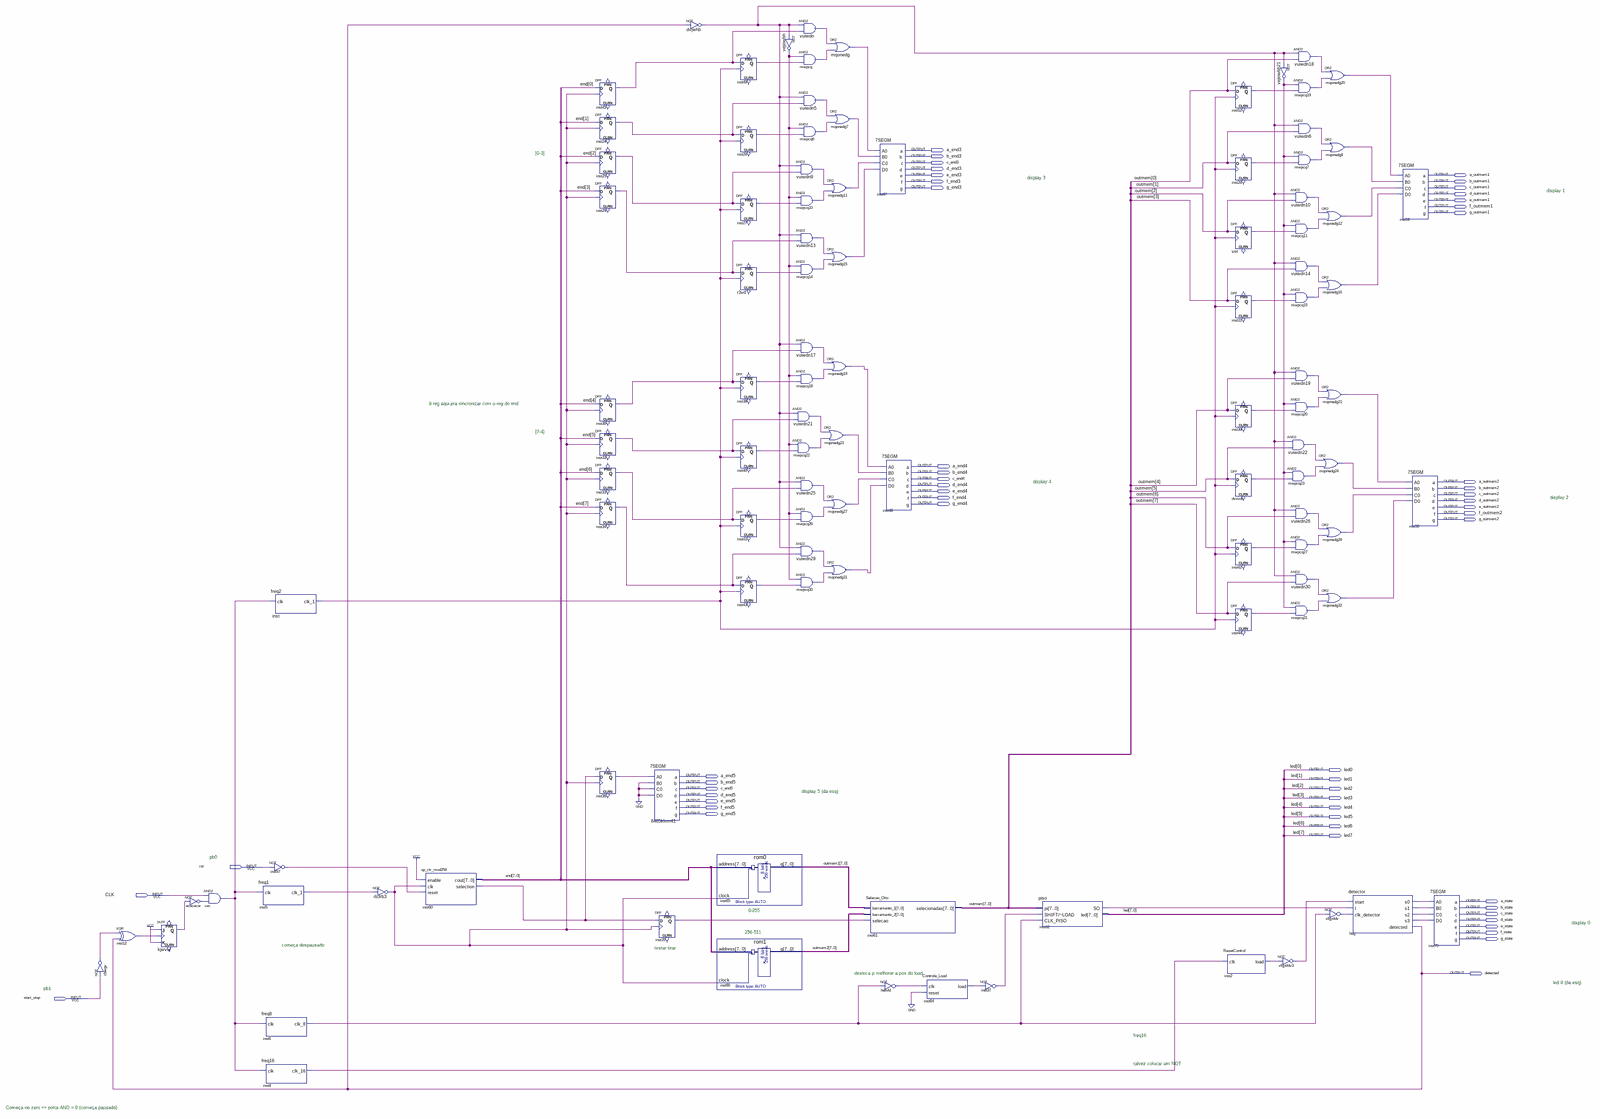
[diagram p0: schematic sheet, whole]
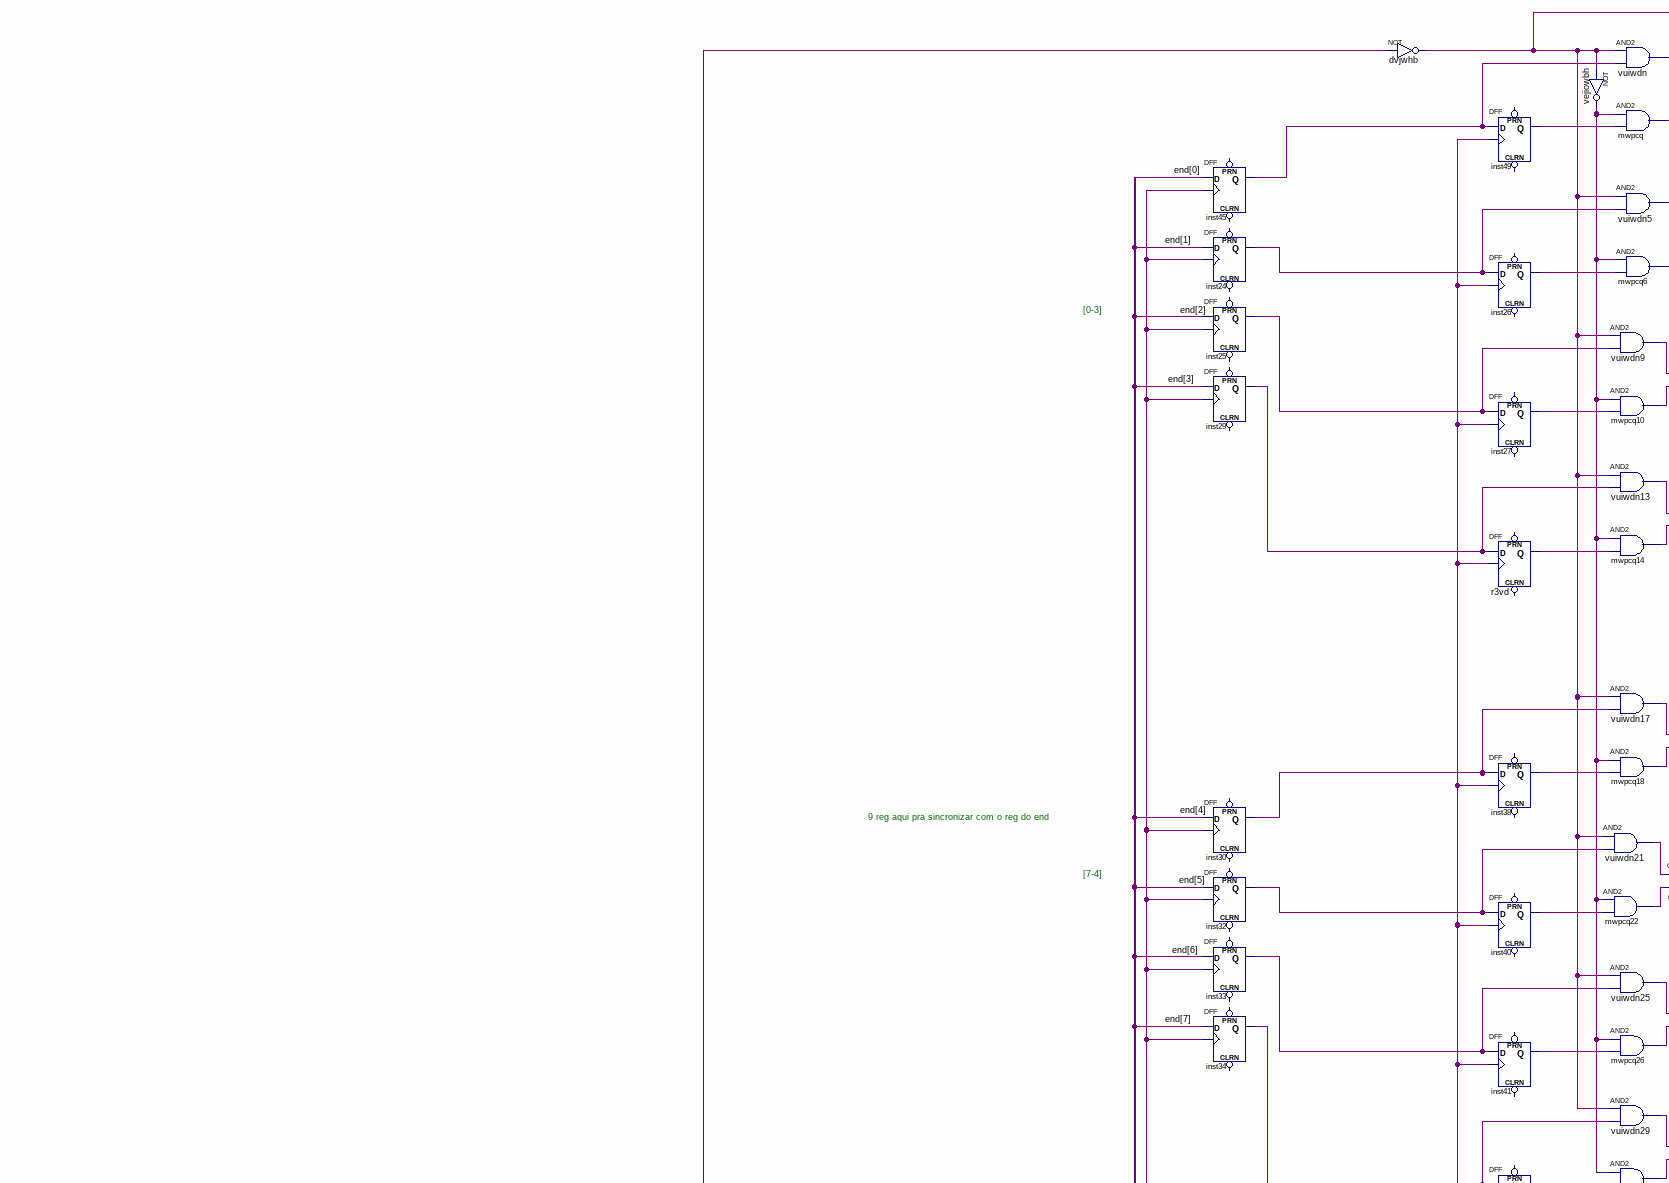
[diagram p1: schematic sheet, upper left part]
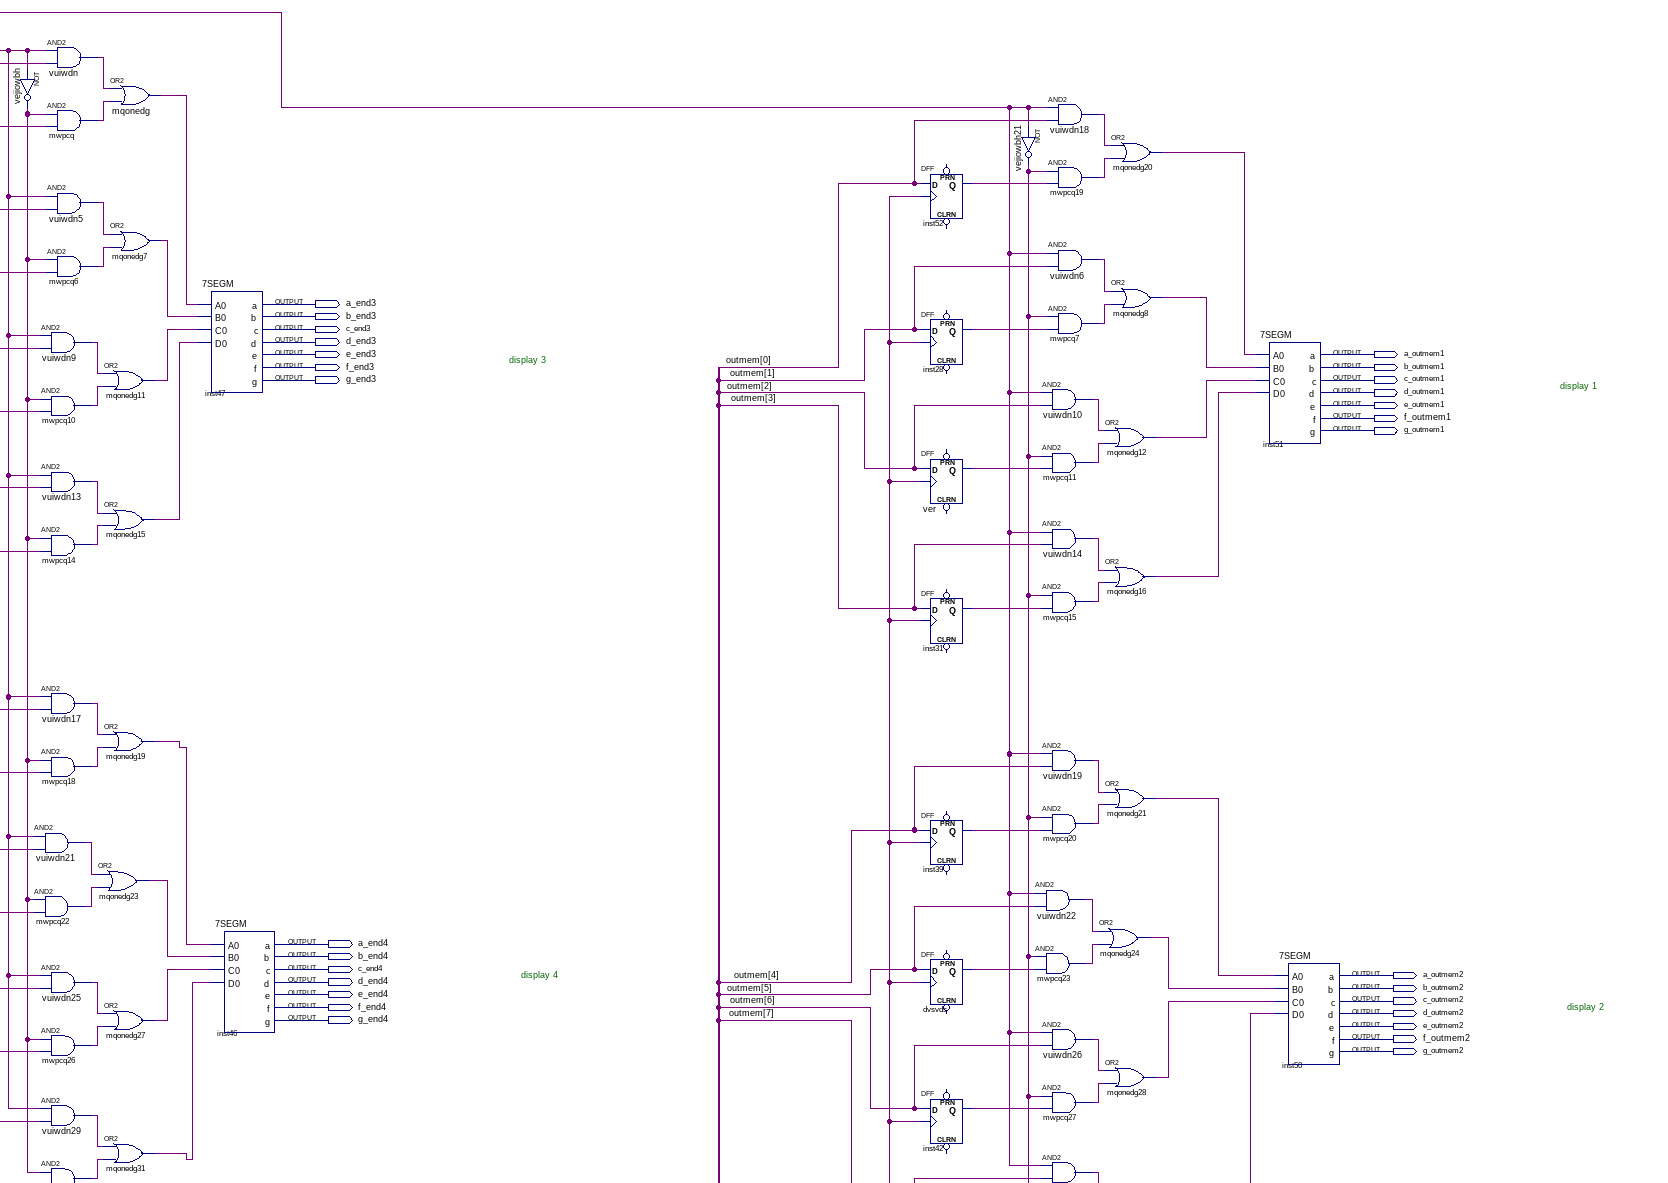
[diagram p2: schematic sheet, upper right part]
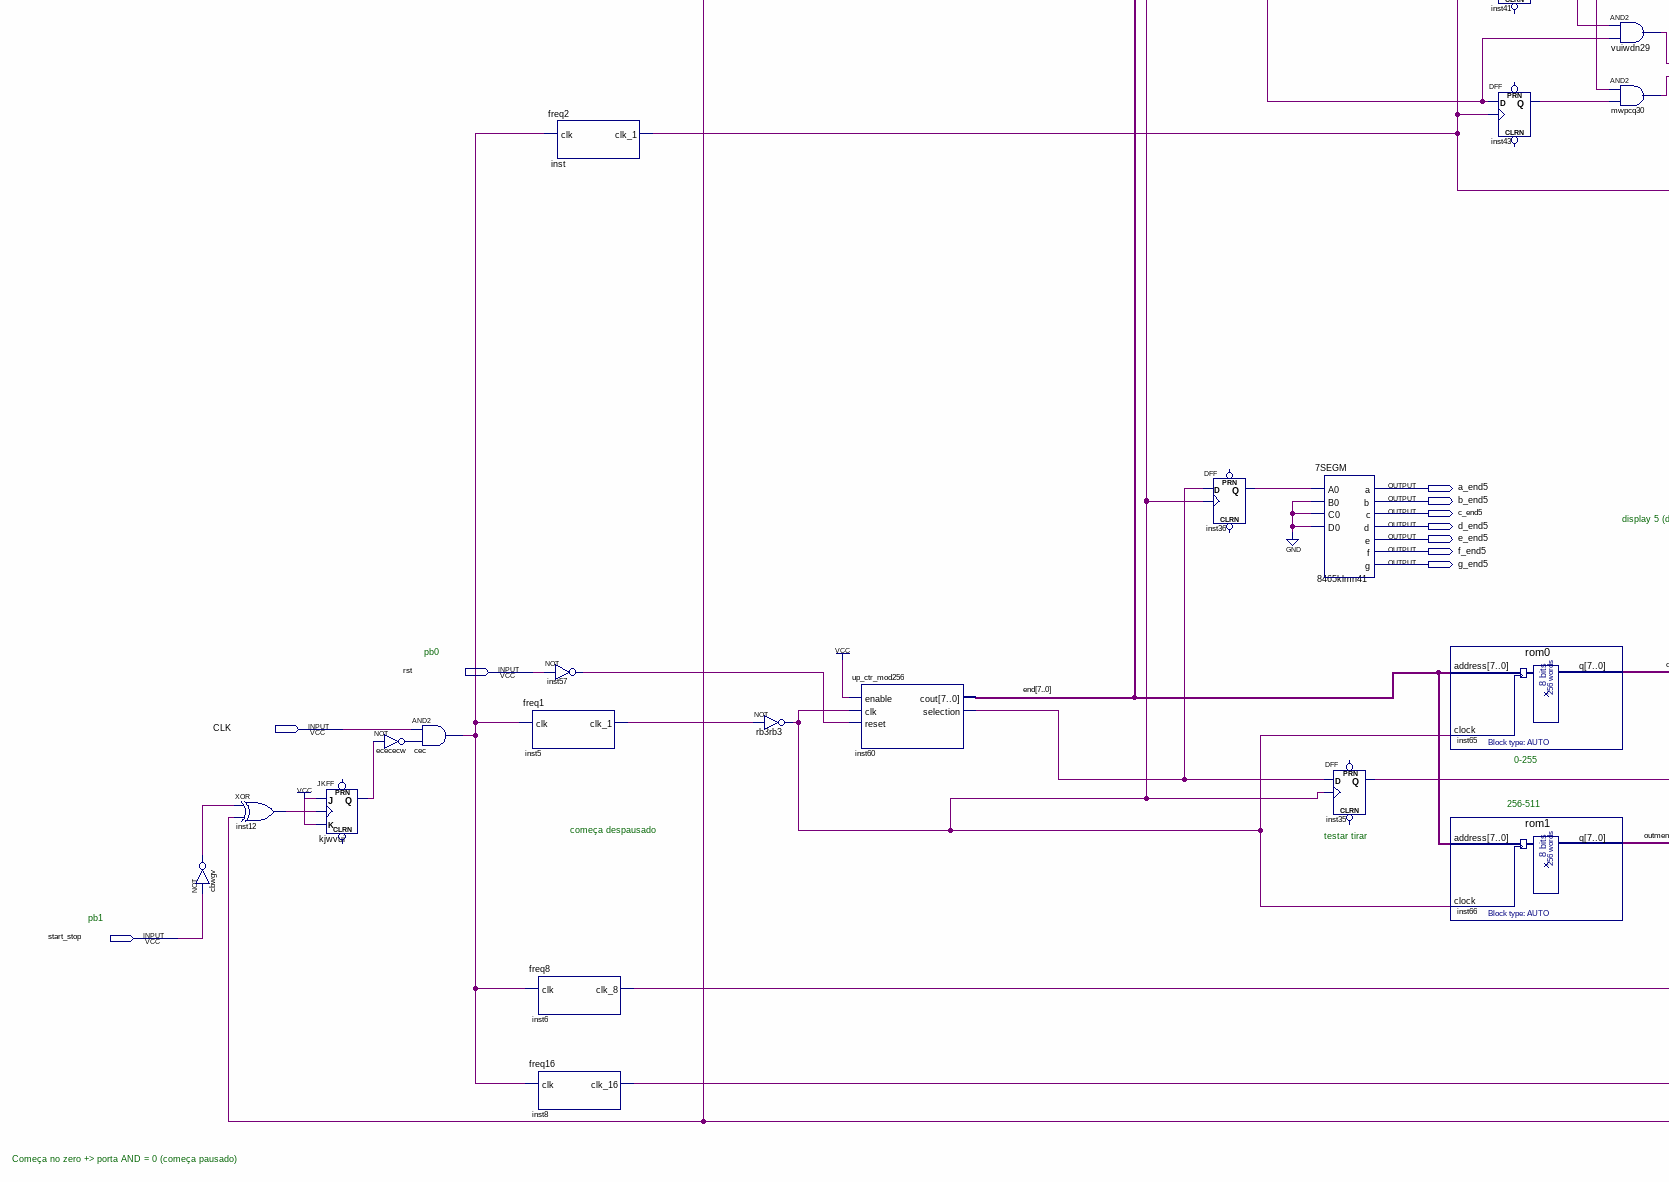
[diagram p3: schematic sheet, lower left part]
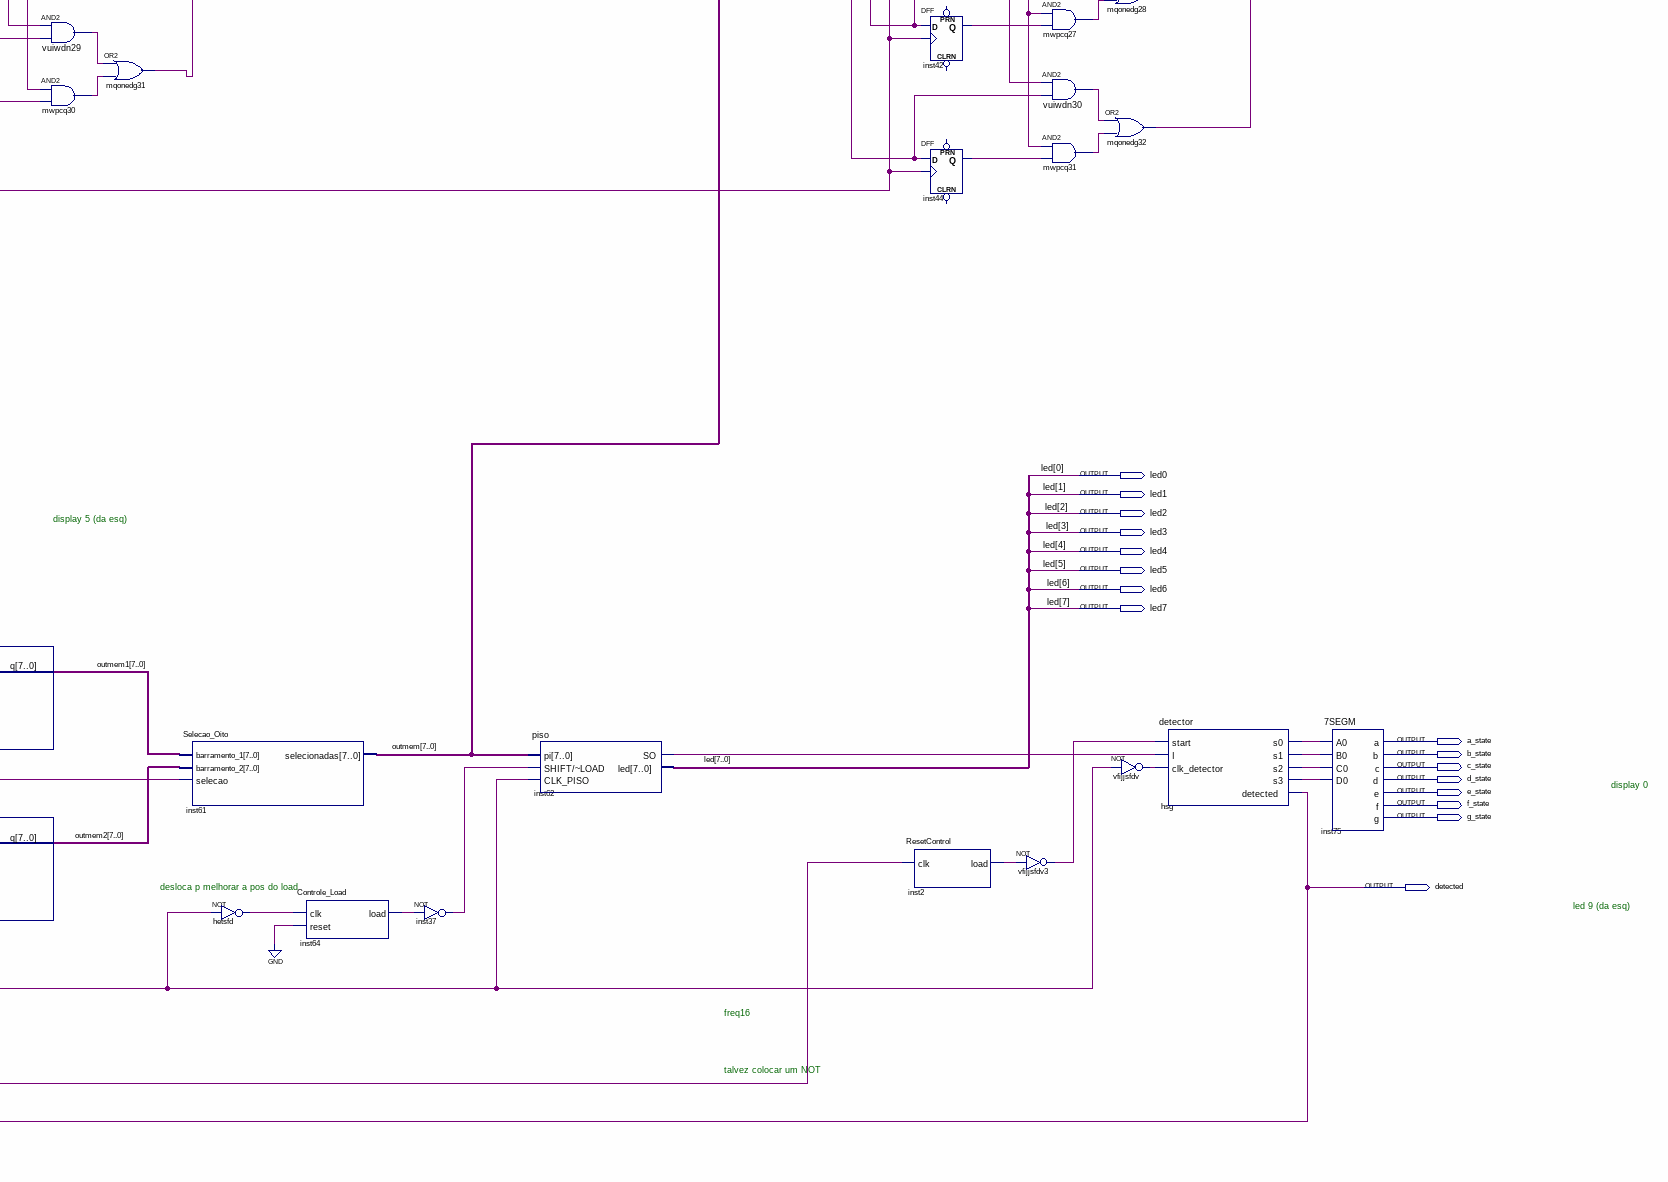
[diagram p4: schematic sheet, lower right part]
// Quartus schematic memoblock.bdf as structural Verilog: 106 symbols, 54 pins
module memoblock (
  input  rst,
  input  CLK,
  input  start_stop,
  output a_end3,
  output b_end3,
  output c_end3,
  output d_end3,
  output e_end3,
  output a_outmem1,
  output f_end3,
  output b_outmem1,
  output g_end3,
  output c_outmem1,
  output d_outmem1,
  output e_outmem1,
  output f_outmem1,
  output g_outmem1,
  output a_end4,
  output b_end4,
  output c_end4,
  output a_outmem2,
  output d_end4,
  output b_outmem2,
  output e_end4,
  output c_outmem2,
  output f_end4,
  output d_outmem2,
  output g_end4,
  output e_outmem2,
  output f_outmem2,
  output g_outmem2,
  output led0,
  output a_end5,
  output led1,
  output b_end5,
  output c_end5,
  output led2,
  output d_end5,
  output led3,
  output e_end5,
  output f_end5,
  output led4,
  output g_end5,
  output led5,
  output led6,
  output led7,
  output a_state,
  output b_state,
  output c_state,
  output d_state,
  output e_state,
  output f_state,
  output g_state,
  output detected
);

  wire cbwgv_out, cec_out, dvjwhb_out, dvsvds_q, ecececw_out, hetsfd_out, hsg_s0, hsg_s1, hsg_s2, hsg_s3,
       inst2_load, inst5_clk_1, inst6_clk_8, inst8_clk_16, inst12_out, inst24_q, inst25_q, inst26_q,
       inst27_q, inst28_q, inst29_q, inst30_q, inst31_q, inst32_q, inst33_q, inst34_q, inst35_q, inst36_q,
       inst37_out, inst38_q, inst39_q, inst40_q, inst41_q, inst42_q, inst43_q, inst44_q, inst45_q, inst49_q,
       inst52_q, inst57_out, inst60_selection, inst62_so, inst64_load, inst_clk_1, kjwvui_q, mqonedg7_out,
       mqonedg8_out, mqonedg11_out, mqonedg12_out, mqonedg15_out, mqonedg16_out, mqonedg19_out,
       mqonedg20_out, mqonedg21_out, mqonedg23_out, mqonedg24_out, mqonedg27_out, mqonedg28_out,
       mqonedg31_out, mqonedg32_out, mqonedg_out, mwpcq6_out, mwpcq7_out, mwpcq10_out, mwpcq11_out,
       mwpcq14_out, mwpcq15_out, mwpcq18_out, mwpcq19_out, mwpcq20_out, mwpcq22_out, mwpcq23_out,
       mwpcq26_out, mwpcq27_out, mwpcq30_out, mwpcq31_out, mwpcq_out, r3vd_q, rb3rb3_out, vejiowbh21_out,
       vejiowbh_out, ver_q, vfijjsfdv3_out, vfijjsfdv_out, vuiwdn5_out, vuiwdn6_out, vuiwdn9_out,
       vuiwdn10_out, vuiwdn13_out, vuiwdn14_out, vuiwdn17_out, vuiwdn18_out, vuiwdn19_out, vuiwdn21_out,
       vuiwdn22_out, vuiwdn25_out, vuiwdn26_out, vuiwdn29_out, vuiwdn30_out, vuiwdn_out;
  wire [7:0] \end , outmem, outmem1, outmem2;

  xor inst12 (inst12_out, cbwgv_out, detected);
  not cbwgv (cbwgv_out, start_stop);
  JKFF kjwvui (.K(1'b1), .J(1'b1), .CLK(inst12_out), .Q(kjwvui_q));  // open: PRN, CLRN
  not ecececw (ecececw_out, kjwvui_q);
  and cec (cec_out, CLK, ecececw_out);
  freq1 inst5 (.clk(cec_out), .clk_1(inst5_clk_1));
  freq8 inst6 (.clk(cec_out), .clk_8(inst6_clk_8));
  freq16 inst8 (.clk(cec_out), .clk_16(inst8_clk_16));
  freq2 inst (.clk(cec_out), .clk_1(inst_clk_1));
  not inst57 (inst57_out, rst);
  not rb3rb3 (rb3rb3_out, inst5_clk_1);
  up_ctr_mod256 inst60 (
    .enable(1'b1), .clk(rb3rb3_out), .reset(inst57_out), .cout(\end ), .selection(inst60_selection));
  DFF inst45 (.CLK(rb3rb3_out), .D(\end [0]), .Q(inst45_q));  // open: CLRN, PRN
  DFF inst24 (.CLK(rb3rb3_out), .D(\end [1]), .Q(inst24_q));  // open: CLRN, PRN
  DFF inst25 (.CLK(rb3rb3_out), .D(\end [2]), .Q(inst25_q));  // open: CLRN, PRN
  DFF inst29 (.CLK(rb3rb3_out), .D(\end [3]), .Q(inst29_q));  // open: CLRN, PRN
  DFF inst30 (.CLK(rb3rb3_out), .D(\end [4]), .Q(inst30_q));  // open: CLRN, PRN
  DFF inst32 (.CLK(rb3rb3_out), .D(\end [5]), .Q(inst32_q));  // open: CLRN, PRN
  DFF inst33 (.CLK(rb3rb3_out), .D(\end [6]), .Q(inst33_q));  // open: CLRN, PRN
  DFF inst34 (.CLK(rb3rb3_out), .D(\end [7]), .Q(inst34_q));  // open: CLRN, PRN
  DFF inst36 (.CLK(rb3rb3_out), .D(inst60_selection), .Q(inst36_q));  // open: CLRN, PRN
  \7SEGM  u_8465klmn41 (
    .A0(inst36_q), .B0(1'b0), .C0(1'b0), .D0(1'b0), .a(a_end5), .b(b_end5), .c(c_end5), .d(d_end5),
    .e(e_end5), .f(f_end5), .g(g_end5));
  DFF inst35 (.CLK(rb3rb3_out), .D(inst60_selection), .Q(inst35_q));  // open: CLRN, PRN
  not dvjwhb (dvjwhb_out, detected);
  rom0 inst65 (.address(\end ), .clock(rb3rb3_out), .q(outmem1));
  rom1 inst66 (.address(\end ), .clock(rb3rb3_out), .q(outmem2));
  DFF inst49 (.CLK(inst_clk_1), .D(inst45_q), .Q(inst49_q));  // open: CLRN, PRN
  DFF inst26 (.CLK(inst_clk_1), .D(inst24_q), .Q(inst26_q));  // open: CLRN, PRN
  DFF inst27 (.CLK(inst_clk_1), .D(inst25_q), .Q(inst27_q));  // open: CLRN, PRN
  DFF r3vd (.CLK(inst_clk_1), .D(inst29_q), .Q(r3vd_q));  // open: CLRN, PRN
  DFF inst38 (.CLK(inst_clk_1), .D(inst30_q), .Q(inst38_q));  // open: CLRN, PRN
  DFF inst40 (.CLK(inst_clk_1), .D(inst32_q), .Q(inst40_q));  // open: CLRN, PRN
  DFF inst41 (.CLK(inst_clk_1), .D(inst33_q), .Q(inst41_q));  // open: CLRN, PRN
  DFF inst43 (.CLK(inst_clk_1), .D(inst34_q), .Q(inst43_q));  // open: CLRN, PRN
  not vejiowbh (vejiowbh_out, dvjwhb_out);
  and vuiwdn21 (vuiwdn21_out, dvjwhb_out, inst32_q);
  and mwpcq22 (mwpcq22_out, vejiowbh_out, inst40_q);
  and vuiwdn (vuiwdn_out, dvjwhb_out, inst45_q);
  and mwpcq (mwpcq_out, vejiowbh_out, inst49_q);
  and vuiwdn5 (vuiwdn5_out, dvjwhb_out, inst24_q);
  and mwpcq6 (mwpcq6_out, vejiowbh_out, inst26_q);
  and vuiwdn9 (vuiwdn9_out, dvjwhb_out, inst25_q);
  and mwpcq10 (mwpcq10_out, vejiowbh_out, inst27_q);
  and vuiwdn13 (vuiwdn13_out, dvjwhb_out, inst29_q);
  and mwpcq14 (mwpcq14_out, vejiowbh_out, r3vd_q);
  and vuiwdn17 (vuiwdn17_out, dvjwhb_out, inst30_q);
  and mwpcq18 (mwpcq18_out, vejiowbh_out, inst38_q);
  and vuiwdn25 (vuiwdn25_out, dvjwhb_out, inst33_q);
  and mwpcq26 (mwpcq26_out, vejiowbh_out, inst41_q);
  and vuiwdn29 (vuiwdn29_out, dvjwhb_out, inst34_q);
  and mwpcq30 (mwpcq30_out, vejiowbh_out, inst43_q);
  or mqonedg (mqonedg_out, vuiwdn_out, mwpcq_out);
  or mqonedg7 (mqonedg7_out, vuiwdn5_out, mwpcq6_out);
  or mqonedg11 (mqonedg11_out, vuiwdn9_out, mwpcq10_out);
  or mqonedg15 (mqonedg15_out, vuiwdn13_out, mwpcq14_out);
  or mqonedg19 (mqonedg19_out, vuiwdn17_out, mwpcq18_out);
  or mqonedg23 (mqonedg23_out, vuiwdn21_out, mwpcq22_out);
  or mqonedg27 (mqonedg27_out, vuiwdn25_out, mwpcq26_out);
  or mqonedg31 (mqonedg31_out, vuiwdn29_out, mwpcq30_out);
  Selecao_Oito inst61 (.barramento_1(outmem1), .barramento_2(outmem2), .selecao(inst35_q), .selecionadas(outmem));
  \7SEGM  inst47 (
    .A0(mqonedg_out), .B0(mqonedg7_out), .C0(mqonedg11_out), .D0(mqonedg15_out), .a(a_end3), .b(b_end3),
    .c(c_end3), .d(d_end3), .e(e_end3), .f(f_end3), .g(g_end3));
  \7SEGM  inst46 (
    .A0(mqonedg19_out), .B0(mqonedg23_out), .C0(mqonedg27_out), .D0(mqonedg31_out), .a(a_end4), .b(b_end4),
    .c(c_end4), .d(d_end4), .e(e_end4), .f(f_end4), .g(g_end4));
  not hetsfd (hetsfd_out, inst6_clk_8);
  Controle_Load inst64 (.clk(hetsfd_out), .reset(1'b0), .load(inst64_load));
  not inst37 (inst37_out, inst64_load);
  piso inst62 (
    .pi(outmem), .\SHIFT/~LOAD (inst37_out), .CLK_PISO(inst6_clk_8), .SO(inst62_so),
    .led({led7, led6, led5, led4, led3, led2, led1, led0}));
  DFF inst52 (.CLK(inst_clk_1), .D(outmem[0]), .Q(inst52_q));  // open: CLRN, PRN
  DFF inst28 (.CLK(inst_clk_1), .D(outmem[1]), .Q(inst28_q));  // open: CLRN, PRN
  DFF ver (.CLK(inst_clk_1), .D(outmem[2]), .Q(ver_q));  // open: CLRN, PRN
  DFF inst31 (.CLK(inst_clk_1), .D(outmem[3]), .Q(inst31_q));  // open: CLRN, PRN
  DFF inst39 (.CLK(inst_clk_1), .D(outmem[4]), .Q(inst39_q));  // open: CLRN, PRN
  DFF dvsvds (.CLK(inst_clk_1), .D(outmem[5]), .Q(dvsvds_q));  // open: CLRN, PRN
  DFF inst42 (.CLK(inst_clk_1), .D(outmem[6]), .Q(inst42_q));  // open: CLRN, PRN
  DFF inst44 (.CLK(inst_clk_1), .D(outmem[7]), .Q(inst44_q));  // open: CLRN, PRN
  ResetControl inst2 (.clk(inst8_clk_16), .load(inst2_load));
  and vuiwdn18 (vuiwdn18_out, dvjwhb_out, outmem[0]);
  not vejiowbh21 (vejiowbh21_out, dvjwhb_out);
  and mwpcq19 (mwpcq19_out, vejiowbh21_out, inst52_q);
  and vuiwdn6 (vuiwdn6_out, dvjwhb_out, outmem[1]);
  and mwpcq7 (mwpcq7_out, vejiowbh21_out, inst28_q);
  and vuiwdn10 (vuiwdn10_out, dvjwhb_out, outmem[2]);
  and mwpcq11 (mwpcq11_out, vejiowbh21_out, ver_q);
  and vuiwdn14 (vuiwdn14_out, dvjwhb_out, outmem[3]);
  and mwpcq15 (mwpcq15_out, vejiowbh21_out, inst31_q);
  and vuiwdn19 (vuiwdn19_out, dvjwhb_out, outmem[4]);
  and mwpcq20 (mwpcq20_out, vejiowbh21_out, inst39_q);
  and vuiwdn22 (vuiwdn22_out, dvjwhb_out, outmem[5]);
  and mwpcq23 (mwpcq23_out, vejiowbh21_out, dvsvds_q);
  and vuiwdn26 (vuiwdn26_out, dvjwhb_out, outmem[6]);
  and mwpcq27 (mwpcq27_out, vejiowbh21_out, inst42_q);
  and vuiwdn30 (vuiwdn30_out, dvjwhb_out, outmem[7]);
  and mwpcq31 (mwpcq31_out, vejiowbh21_out, inst44_q);
  not vfijjsfdv3 (vfijjsfdv3_out, inst2_load);
  or mqonedg24 (mqonedg24_out, vuiwdn22_out, mwpcq23_out);
  or mqonedg20 (mqonedg20_out, vuiwdn18_out, mwpcq19_out);
  or mqonedg8 (mqonedg8_out, vuiwdn6_out, mwpcq7_out);
  or mqonedg12 (mqonedg12_out, vuiwdn10_out, mwpcq11_out);
  or mqonedg16 (mqonedg16_out, vuiwdn14_out, mwpcq15_out);
  or mqonedg21 (mqonedg21_out, vuiwdn19_out, mwpcq20_out);
  or mqonedg28 (mqonedg28_out, vuiwdn26_out, mwpcq27_out);
  or mqonedg32 (mqonedg32_out, vuiwdn30_out, mwpcq31_out);
  not vfijjsfdv (vfijjsfdv_out, inst6_clk_8);
  detector hsg (
    .start(vfijjsfdv3_out), .I(inst62_so), .clk_detector(vfijjsfdv_out), .s0(hsg_s0), .s1(hsg_s1),
    .s2(hsg_s2), .s3(hsg_s3), .detected(detected));
  \7SEGM  inst51 (
    .A0(mqonedg20_out), .B0(mqonedg8_out), .C0(mqonedg12_out), .D0(mqonedg16_out), .a(a_outmem1),
    .b(b_outmem1), .c(c_outmem1), .d(d_outmem1), .e(e_outmem1), .f(f_outmem1), .g(g_outmem1));
  \7SEGM  inst50 (
    .A0(mqonedg21_out), .B0(mqonedg24_out), .C0(mqonedg28_out), .D0(mqonedg32_out), .a(a_outmem2),
    .b(b_outmem2), .c(c_outmem2), .d(d_outmem2), .e(e_outmem2), .f(f_outmem2), .g(g_outmem2));
  \7SEGM  inst75 (
    .A0(hsg_s0), .B0(hsg_s1), .C0(hsg_s2), .D0(hsg_s3), .a(a_state), .b(b_state), .c(c_state), .d(d_state),
    .e(e_state), .f(f_state), .g(g_state));

  // Notes on the sheet:
  //   [0-3]
  //   display 3
  //   display 1
  //   9 reg aqui pra sincronizar com o reg do end
  //   [7-4]
  //   display 4
  //   display 2
  //   display 5 (da esq)
  //   pb0
  //   0-255
  //   display 0
  //   256-511
  //   começa despausado
  //   testar tirar
  //   desloca p melhorar a pos do load
  //   led 9 (da esq)
  //   pb1
  //   freq16
  //   talvez colocar um NOT
  //   Começa no zero +> porta AND = 0 (começa pausado)
endmodule
